# EAGLE schematic untitled (EAGLE 7.4.0)
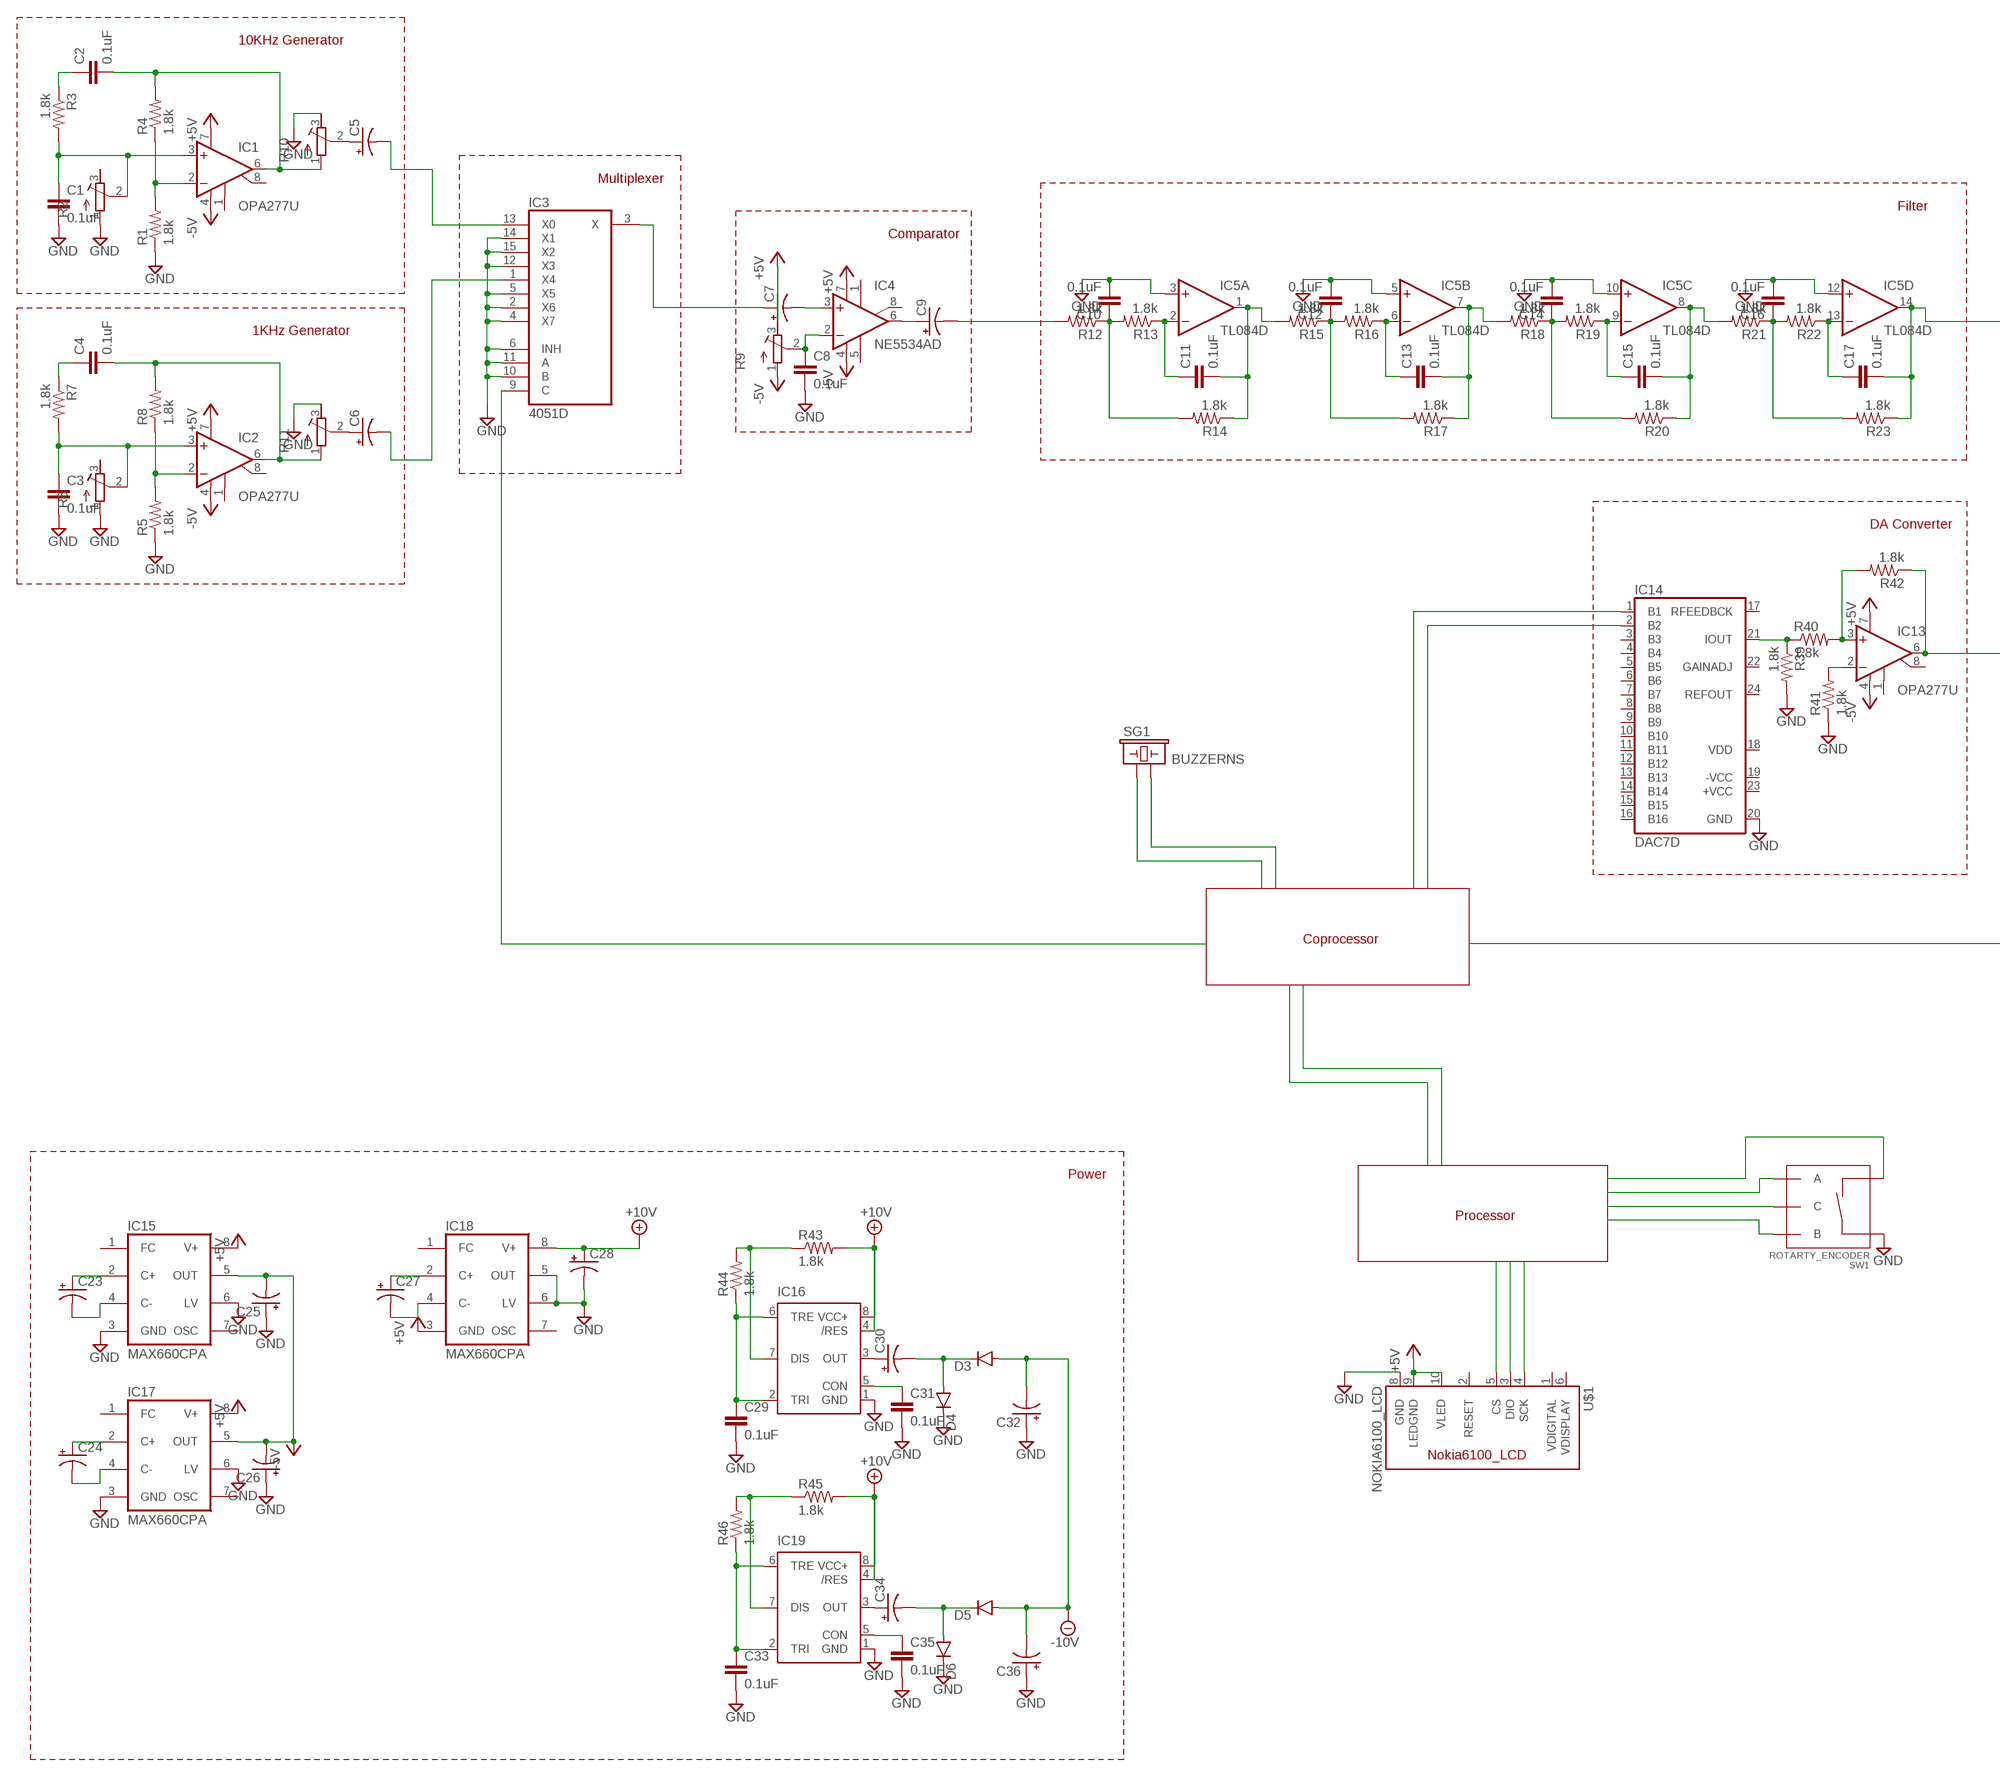
[diagram p0: schematic, sheet 1, part 1 of 2]
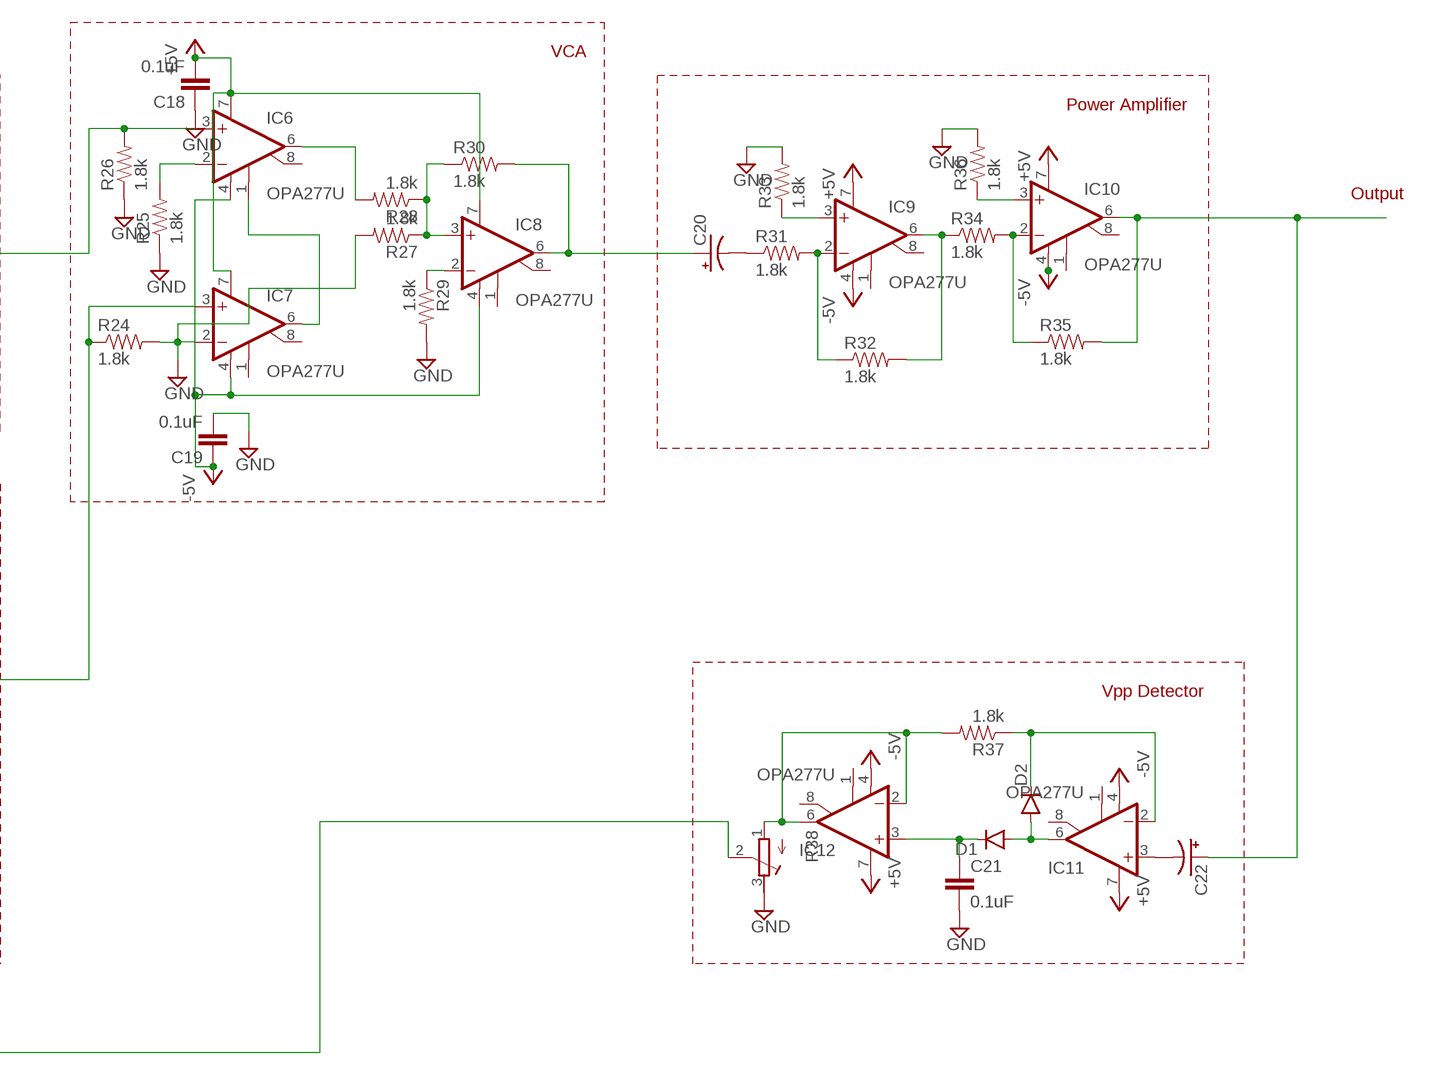
[diagram p1: schematic, sheet 1, part 2 of 2]

## Parts
C1  0.1uF  0.1UF-25V-5%(0603)  [0603-CAP]
C2  0.1uF  0.1UF-25V-5%(0603)  [0603-CAP]
C3  0.1uF  0.1UF-25V-5%(0603)  [0603-CAP]
C4  0.1uF  0.1UF-25V-5%(0603)  [0603-CAP]
C5  CAP_POLC  [PANASONIC_C]
C6  CAP_POLC  [PANASONIC_C]
C7  CAP_POLC  [PANASONIC_C]
C8  0.1uF  0.1UF-25V-5%(0603)  [0603-CAP]
C9  CAP_POLC  [PANASONIC_C]
C10  0.1uF  0.1UF-25V-5%(0603)  [0603-CAP]
C11  0.1uF  0.1UF-25V-5%(0603)  [0603-CAP]
C12  0.1uF  0.1UF-25V-5%(0603)  [0603-CAP]
C13  0.1uF  0.1UF-25V-5%(0603)  [0603-CAP]
C14  0.1uF  0.1UF-25V-5%(0603)  [0603-CAP]
C15  0.1uF  0.1UF-25V-5%(0603)  [0603-CAP]
C16  0.1uF  0.1UF-25V-5%(0603)  [0603-CAP]
C17  0.1uF  0.1UF-25V-5%(0603)  [0603-CAP]
C18  0.1uF  0.1UF-25V-5%(0603)  [0603-CAP]
C19  0.1uF  0.1UF-25V-5%(0603)  [0603-CAP]
C20  CAP_POLC  [PANASONIC_C]
C21  0.1uF  0.1UF-25V-5%(0603)  [0603-CAP]
C22  CAP_POLC  [PANASONIC_C]
C23  CAP_POLC  [PANASONIC_C]
C24  CAP_POLC  [PANASONIC_C]
C25  CAP_POLC  [PANASONIC_C]
C26  CAP_POLC  [PANASONIC_C]
C27  CAP_POLC  [PANASONIC_C]
C28  CAP_POLC  [PANASONIC_C]
C29  0.1uF  0.1UF-25V-5%(0603)  [0603-CAP]
C30  CAP_POLC  [PANASONIC_C]
C31  0.1uF  0.1UF-25V-5%(0603)  [0603-CAP]
C32  CAP_POLC  [PANASONIC_C]
C33  0.1uF  0.1UF-25V-5%(0603)  [0603-CAP]
C34  CAP_POLC  [PANASONIC_C]
C35  0.1uF  0.1UF-25V-5%(0603)  [0603-CAP]
C36  CAP_POLC  [PANASONIC_C]
D1  DIODE1N4148  [DIODE-1N4148]
D2  DIODE1N4148  [DIODE-1N4148]
D3  DIODE1N4148  [DIODE-1N4148]
D4  DIODE1N4148  [DIODE-1N4148]
D5  DIODE1N4148  [DIODE-1N4148]
D6  DIODE1N4148  [DIODE-1N4148]
IC1  OPA277U  [SO08]
IC2  OPA277U  [SO08]
IC3  4051D  [SO16]
IC4  NE5534AD  [SO08]
IC5  TL084D  [SO14]
IC6  OPA277U  [SO08]
IC7  OPA277U  [SO08]
IC8  OPA277U  [SO08]
IC9  OPA277U  [SO08]
IC10  OPA277U  [SO08]
IC11  OPA277U  [SO08]
IC12  OPA277U  [SO08]
IC13  OPA277U  [SO08]
IC14  DAC7D  [SO24W]
IC15  MAX660CPA  [DIL08]
IC16  NE555D  [SO08]
IC17  MAX660CPA  [DIL08]
IC18  MAX660CPA  [DIL08]
IC19  NE555D  [SO08]
R1  1.8k  1.8KOHM1/10W1%(0603)  [0603-RES]
R2  R-TRIMM64W  [RTRIM64W]
R3  1.8k  1.8KOHM1/10W1%(0603)  [0603-RES]
R4  1.8k  1.8KOHM1/10W1%(0603)  [0603-RES]
R5  1.8k  1.8KOHM1/10W1%(0603)  [0603-RES]
R6  R-TRIMM64W  [RTRIM64W]
R7  1.8k  1.8KOHM1/10W1%(0603)  [0603-RES]
R8  1.8k  1.8KOHM1/10W1%(0603)  [0603-RES]
R9  R-TRIMM64W  [RTRIM64W]
R10  R-TRIMM64W  [RTRIM64W]
R11  R-TRIMM64W  [RTRIM64W]
R12  1.8k  1.8KOHM1/10W1%(0603)  [0603-RES]
R13  1.8k  1.8KOHM1/10W1%(0603)  [0603-RES]
R14  1.8k  1.8KOHM1/10W1%(0603)  [0603-RES]
R15  1.8k  1.8KOHM1/10W1%(0603)  [0603-RES]
R16  1.8k  1.8KOHM1/10W1%(0603)  [0603-RES]
R17  1.8k  1.8KOHM1/10W1%(0603)  [0603-RES]
R18  1.8k  1.8KOHM1/10W1%(0603)  [0603-RES]
R19  1.8k  1.8KOHM1/10W1%(0603)  [0603-RES]
R20  1.8k  1.8KOHM1/10W1%(0603)  [0603-RES]
R21  1.8k  1.8KOHM1/10W1%(0603)  [0603-RES]
R22  1.8k  1.8KOHM1/10W1%(0603)  [0603-RES]
R23  1.8k  1.8KOHM1/10W1%(0603)  [0603-RES]
R24  1.8k  1.8KOHM1/10W1%(0603)  [0603-RES]
R25  1.8k  1.8KOHM1/10W1%(0603)  [0603-RES]
R26  1.8k  1.8KOHM1/10W1%(0603)  [0603-RES]
R27  1.8k  1.8KOHM1/10W1%(0603)  [0603-RES]
R28  1.8k  1.8KOHM1/10W1%(0603)  [0603-RES]
R29  1.8k  1.8KOHM1/10W1%(0603)  [0603-RES]
R30  1.8k  1.8KOHM1/10W1%(0603)  [0603-RES]
R31  1.8k  1.8KOHM1/10W1%(0603)  [0603-RES]
R32  1.8k  1.8KOHM1/10W1%(0603)  [0603-RES]
R33  1.8k  1.8KOHM1/10W1%(0603)  [0603-RES]
R34  1.8k  1.8KOHM1/10W1%(0603)  [0603-RES]
R35  1.8k  1.8KOHM1/10W1%(0603)  [0603-RES]
R36  1.8k  1.8KOHM1/10W1%(0603)  [0603-RES]
R37  1.8k  1.8KOHM1/10W1%(0603)  [0603-RES]
R38  R-TRIMM64W  [RTRIM64W]
R39  1.8k  1.8KOHM1/10W1%(0603)  [0603-RES]
R40  1.8k  1.8KOHM1/10W1%(0603)  [0603-RES]
R41  1.8k  1.8KOHM1/10W1%(0603)  [0603-RES]
R42  1.8k  1.8KOHM1/10W1%(0603)  [0603-RES]
R43  1.8k  1.8KOHM1/10W1%(0603)  [0603-RES]
R44  1.8k  1.8KOHM1/10W1%(0603)  [0603-RES]
R45  1.8k  1.8KOHM1/10W1%(0603)  [0603-RES]
R46  1.8k  1.8KOHM1/10W1%(0603)  [0603-RES]
SG1  BUZZERNS  [BUZZER-12MM-NS]
SW1  ROTARTY_ENCODER  [ROTARY_ENC_PLAIN]
U$1  NOKIA6100_LCD  [NOKIA6100_LCD]

## Nets
+5V: C18.2 IC1.7(V+) IC2.7(V+) IC4.7(V+) IC6.7(V+) IC7.7(V+) IC8.7(V+) IC9.7(V+) IC10.7(V+) IC11.7(V+) IC12.7(V+) IC13.7(V+) IC15.8(V+) IC17.8(V+) IC18.3(GND) R9.3(E) U$1.9(LEDGND) U$1.10(VLED)
+10V: C28.+ IC16.4(/RES) IC16.8(VCC+) IC18.8(V+) IC19.4(/RES) IC19.8(VCC+) R43.2 R45.2
-5V: C19.1 IC1.4(V-) IC2.4(V-) IC4.4(V-) IC6.4(V-) IC7.4(V-) IC8.4(V-) IC9.4(V-) IC10.4(V-) IC11.4(V-) IC12.4(V-) IC13.4(V-) R9.1(A)
-10V: C32.- C36.- D3.A D5.A
GND: C1.2 C3.2 C8.2 C10.2 C12.2 C14.2 C16.2 C18.1 C19.2 C21.2 C25.+ C26.+ C28.- C29.2 C31.2 C32.+ C33.2 C35.2 C36.+ D4.C D6.C IC3.2(X6) IC3.4(X7) IC3.5(X5) IC3.6(INH) IC3.10(B) IC3.11(A) IC3.12(X3) IC3.14(X1) IC3.15(X2) IC5.3(A:+IN) IC5.5(B:+IN) IC5.10(C:+IN) IC5.12(D:+IN) IC7.2(-IN) IC14.20(GND) IC15.3(GND) IC15.6(LV) IC16.1(GND) IC17.3(GND) IC17.6(LV) IC18.5(OUT) IC18.6(LV) IC19.1(GND) R1.1 R2.1(A) R5.1 R6.1(A) R10.3(E) R11.3(E) R24.2 R25.1 R26.1 R27.2 R29.2 R33.2 R36.2 R38.3(E) R39.2 R41.1 SW1.SW+ U$1.8(GND)
N$1: C1.1 IC1.3(+IN) R2.2(S) R3.2
N$2: C2.1 R3.1
N$3: IC1.2(-IN) R1.2 R4.1
N$4: C2.2 IC1.6(OUT) R4.2 R10.1(A)
N$5: C3.1 IC2.3(+IN) R6.2(S) R7.2
N$6: IC2.2(-IN) R5.2 R8.1
N$7: C4.2 IC2.6(OUT) R8.2 R11.1(A)
N$8: C4.1 R7.1
N$9: C7.+ IC3.3(X)
N$10: IC3.9(C)
N$11: C8.1 IC4.2(-IN) R9.2(S)
N$12: C5.- IC3.13(X0)
N$13: C5.+ R10.2(S)
N$14: C6.+ R11.2(S)
N$15: C6.- IC3.1(X4)
N$16: C7.- IC4.3(+IN)
N$17: C9.+ IC4.6(OUT)
N$18: C9.- R12.2
N$19: C11.1 IC5.2(A:-IN) R13.1
N$20: C10.1 R12.1 R13.2 R14.2
N$21: C11.2 IC5.1(A:OUT) R14.1 R15.2
N$22: C13.1 IC5.6(B:-IN) R16.1
N$23: C12.1 R15.1 R16.2 R17.2
N$24: C13.2 IC5.7(B:OUT) R17.1 R18.2
N$25: C15.1 IC5.9(C:-IN) R19.1
N$26: C14.1 R18.1 R19.2 R20.2
N$27: C15.2 IC5.8(C:OUT) R20.1 R21.2
N$28: C17.1 IC5.13(D:-IN) R22.1
N$29: C16.1 R21.1 R22.2 R23.2
N$30: IC9.3(+IN) R33.1
N$31: IC6.1(CMP1) IC7.6(OUT)
N$32: IC14.1(B1)
N$33: IC6.2(-IN) R25.2
N$34: C17.2 IC5.14(D:OUT) IC6.3(+IN) R23.1 R26.2
N$35: IC6.6(OUT) R28.2
N$36: IC8.3(+IN) R27.1 R28.1 R30.1
N$37: IC9.2(-IN) R31.2 R32.1
N$38: IC8.2(-IN) R29.1
N$39: IC8.6(OUT) R30.2
N$40: IC9.6(OUT) R32.2 R34.1
N$41: C20.- R31.1
N$42: IC10.3(+IN) R36.1
N$43: IC10.2(-IN) R34.2 R35.1
N$44: C22.+ IC10.6(OUT) R35.2
N$45: D2.C IC11.2(-IN) R37.1
N$46: IC12.2(-IN) IC12.6(OUT) R37.2 R38.1(A)
N$47: D1.A D2.A IC11.6(OUT)
N$48: C21.1 D1.C IC12.3(+IN)
N$49: C22.- IC11.3(+IN)
N$50: R38.2(S)
N$51: IC14.21(IOUT) R39.1 R40.1
N$52: IC13.3(+IN) R40.2 R42.2
N$53: IC7.3(+IN) IC13.6(OUT) R24.1 R42.1
N$54: IC13.2(-IN) R41.2
N$55: IC14.2(B2)
N$56: C24.- IC17.4(C-)
N$57: C24.+ IC17.2(C+)
N$58: C23.+ IC15.2(C+)
N$59: C23.- IC15.4(C-)
N$60: C27.- IC18.4(C-)
N$61: C27.+ IC18.2(C+)
N$64: SG1.-
N$65: IC16.7(DIS) R43.1 R44.2
N$66: C29.1 IC16.2(TRI) IC16.6(TRE) R44.1
N$67: C30.+ IC16.3(OUT)
N$68: C31.1 IC16.5(CON)
N$69: C30.- D3.C D4.A
N$70: SG1.+
N$71: IC19.7(DIS) R45.1 R46.2
N$72: C33.1 IC19.2(TRI) IC19.6(TRE) R46.1
N$73: C34.+ IC19.3(OUT)
N$74: C35.1 IC19.5(CON)
N$75: C34.- D5.C D6.A
N$76: SW1.A
N$77: SW1.C
N$78: SW1.B
N$79: SW1.SW-
N$80: U$1.4(SCK)
N$81: U$1.3(DIO)
N$82: U$1.5(CS)
OUT: C25.- C26.- IC15.5(OUT) IC17.5(OUT) ; supply symbol labelled -5V
Unconnected: C20.+ IC1.1(CMP1) IC1.8(CMP2) IC2.1(CMP1) IC2.8(CMP2) IC4.1(ON) IC4.5(CMP) IC4.8(ON/CMP) IC6.8(CMP2) IC7.1(CMP1) IC7.8(CMP2) IC8.1(CMP1) IC8.8(CMP2) IC9.1(CMP1) IC9.8(CMP2) IC10.1(CMP1) IC10.8(CMP2) IC11.1(CMP1) IC11.8(CMP2) IC12.1(CMP1) IC12.8(CMP2) IC13.1(CMP1) IC13.8(CMP2) IC14.3(B3) IC14.4(B4) IC14.5(B5) IC14.6(B6) IC14.7(B7) IC14.8(B8) IC14.9(B9) IC14.10(B10) IC14.11(B11) IC14.12(B12) IC14.13(B13) IC14.14(B14) IC14.15(B15) IC14.16(B16) IC14.17(RFEEDBCK) IC14.22(GAINADJ) IC14.24(REFOUT) IC15.1(FC) IC15.7(OSC) IC17.1(FC) IC17.7(OSC) IC18.1(FC) IC18.7(OSC) R2.3(E) R6.3(E) U$1.1(VDIGITAL) U$1.2(RESET) U$1.6(VDISPLAY)

## Notes on the sheet
- 10KHz Generator
- VCA
- Multiplexer
- Filter | Power Amplifier
- Comparator
- Output
- 1KHz Generator
- DA Converter
- Vpp Detector
- Coprocessor
- Power
- Processor

## Power pins joined to a net without a drawn wire
+VCC: IC14.23(+VCC)
-VCC: IC14.19(-VCC)
GND: IC3.8(GND)
V+: IC5.4(P:V+)
V-: IC5.11(P:V-)
VCC: IC3.16(VCC)
VDD: IC14.18(VDD)
VEE: IC3.7(VEE)

## Library data of the parts
C1-C4 C8 C10-C19 C21 C29 C31 C33 C35 = SparkFun-Capacitors:0.1UF-25V-5%(0603): CAP-08604; PROD_ID: CAP-08604
C5-C7 C9 C20 C22-C28 C30 C32 C34 C36 = SparkFun-Capacitors:CAP_POL: Capacitor Polarized These are standard SMD and PTH capacitors. Normally 10uF, 47uF, and 100uF in electrolytic and tantalum varieties. Always verify the external diameter of the through hole cap, it varies with capacity, voltage, and manufacturer. The EIA devices should be standard.
D1-D6 = SparkFun-DiscreteSemi:DIODE: Diode These are standard reverse protection diodes and small signal diodes. SMA package can handle up to about 1A. SOD-323 can handle about 200mA. What the SOD-323 package when ordering, there are some mfgs out there that are 5-pin packages.
IC1 IC2 IC6-IC13 = linear:OPA277: High Precision OPERATIONAL AMPLIFIERS REPLACES OP-07, OP-77, OP-177 Source: opa277.pdf
IC3 = 40xx:4051: 8-channel ANALOG MULTIPLEXER
IC4 = linear:NE5534: LOW-NOISE OPERATIONAL AMPLIFIER Source: http://focus.ti.com/lit/ds/symlink/ne5534.pdf
IC5 = linear:TL084: OP AMP
IC14 = linear:DAC7*: 16-bit DIGITAL/ANALOG CONVERTER
IC15 IC17 IC18 = maxim:MAX660CPA: Charge-pump VOLTAGE CONVERTER; MF: MAXIM; MPN: MAX660CPA; OC_FARNELL: 1187928; OC_NEWARK: 34C3964
IC16 IC19 = SparkFun-AnalogIC:NE555: General purpose bipolar Timer
R1 R3-R5 R7 R8 R12-R37 R39-R46 = SparkFun-Resistors:1.8KOHM1/10W1%(0603): RES-09119; PROD_ID: RES-09119
R2 R6 R9-R11 R38 = resistor:R-TRIMM: Trimm resistor
SG1 = SparkFun-Electromechanical:BUZZER: Buzzer 12mm Spark Fun Electronics SKU : Comp-Buzzer
SW1 = SparkFun-Electromechanical:ROTARTY_ENCODER: Simple no LED rotary encoder Example: COM-09117
U$1 = SparkFun-Displays:NOKIA6100_LCD: Nokia 6100 Color LCD Schematic element and footprint production proven but could use some touching up. Spark Fun Electronics SKU : LCD-00569. Mating SMD connector : LCD-00570